# Altium schematic sheet Processor.SchDoc
size A; SheetNumber: 1; SheetTotal: 1
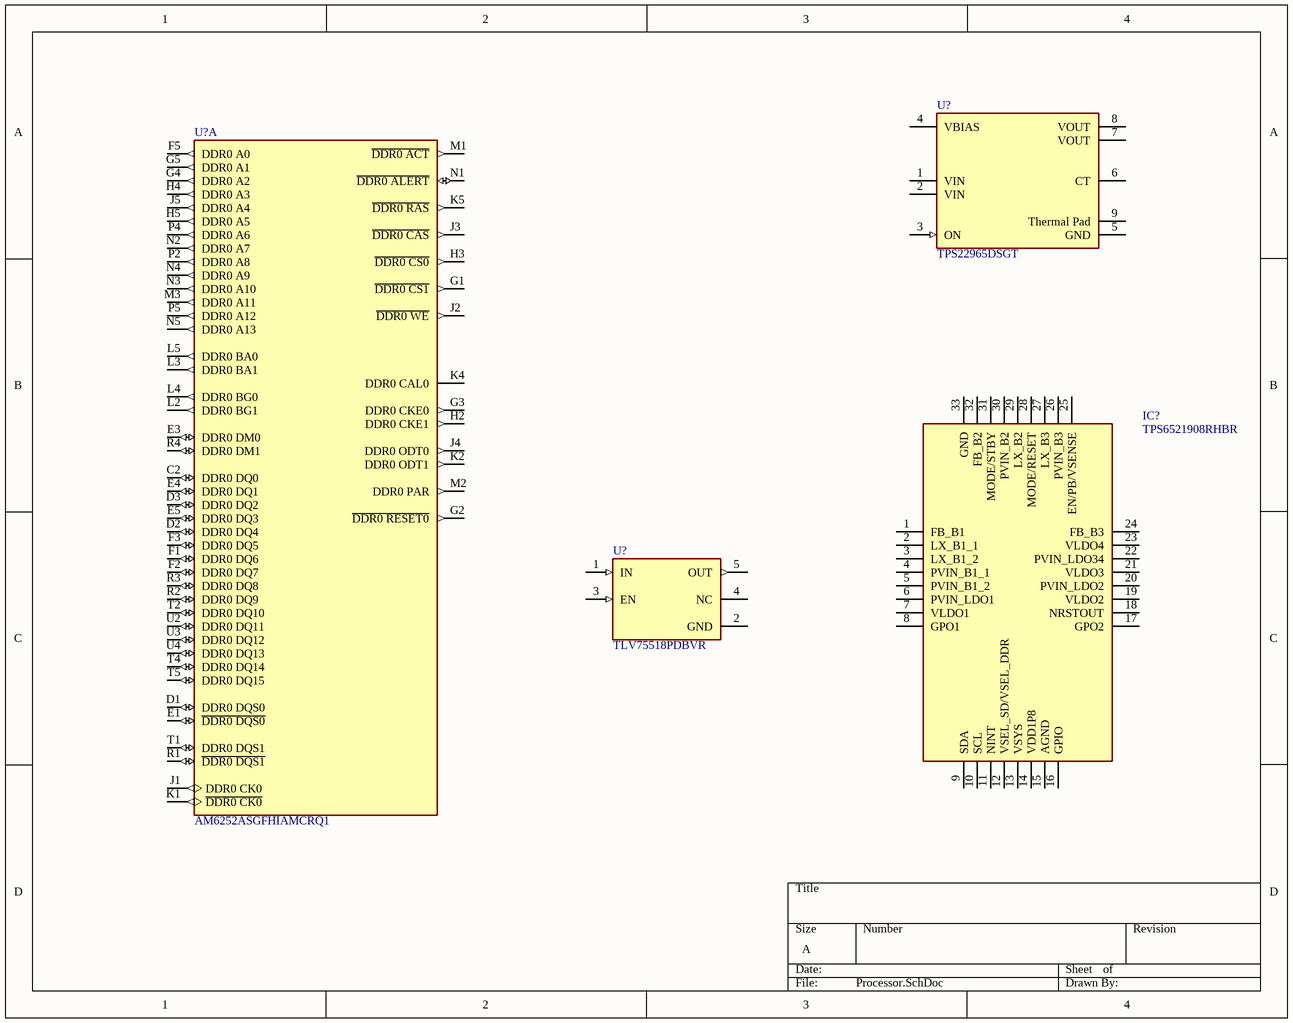
[diagram p0: Processor.SchDoc]

## Parts
(Parts that share a designator on the sheet are numbered #1, #2 ... from top to bottom, then left to right.)
IC?  TPS6521908RHBR  [QFN50P500X500X100-33N-D]
U?#1  TPS22965DSGT  [FP-DSG0008A-MFG]
U?#2  AM6252ASGFHIAMCRQ1  [FP-AMC0441A-MFG]  (part A of 13)
U?#3  TLV75518PDBVR  [FP-DBV0005A-IPC_A]

## Nets

Not connected (* = marked no-connect by the designer): IC? 1(FB_B1) 2(LX_B1_1) 3(LX_B1_2) 4(PVIN_B1_1) 5(PVIN_B1_2) 6(PVIN_LDO1) 7(VLDO1) 8(GPO1) 9(SDA) 10(SCL) 11(NINT) 12(VSEL_SD/VSEL_DDR) 13(VSYS) 14(VDD1P8) 15(AGND) 16(GPIO) 17(GPO2) 18(NRSTOUT) 19(VLDO2) 20(PVIN_LDO2) 21(VLDO3) 22(PVIN_LDO34) 23(VLDO4) 24(FB_B3) 25(EN/PB/VSENSE) 26(PVIN_B3) 27(LX_B3) 28(MODE/RESET) 29(LX_B2) 30(PVIN_B2) 31(MODE/STBY) 32(FB_B2) 33(GND); U?#1 1(VIN) 2(VIN) 3(ON) 4(VBIAS) 5(GND) 6(CT) 7(VOUT) 8(VOUT) 9(Thermal_Pad); U?#2 C2(DDR0_DQ0) D1(DDR0_DQS0) D2(DDR0_DQ4) D3(DDR0_DQ2) E1(~{DDR0_DQS0}) E3(DDR0_DM0) E4(DDR0_DQ1) E5(DDR0_DQ3) F1(DDR0_DQ6) F2(DDR0_DQ7) F3(DDR0_DQ5) F5(DDR0_A0) G1(~{DDR0_CS1}) G2(~{DDR0_RESET0}) G3(DDR0_CKE0) G4(DDR0_A2) G5(DDR0_A1) H2(DDR0_CKE1) H3(~{DDR0_CS0}) H4(DDR0_A3) H5(DDR0_A5) J1(DDR0_CK0) J2(~{DDR0_WE}) J3(~{DDR0_CAS}) J4(DDR0_ODT0) J5(DDR0_A4) K1(~{DDR0_CK0}) K2(DDR0_ODT1) K4(DDR0_CAL0) K5(~{DDR0_RAS}) L2(DDR0_BG1) L3(DDR0_BA1) L4(DDR0_BG0) L5(DDR0_BA0) M1(~{DDR0_ACT}) M2(DDR0_PAR) M3(DDR0_A11) N1(~{DDR0_ALERT}) N2(DDR0_A7) N3(DDR0_A10) N4(DDR0_A9) N5(DDR0_A13) P2(DDR0_A8) P4(DDR0_A6) P5(DDR0_A12) R1(~{DDR0_DQS1}) R2(DDR0_DQ9) R3(DDR0_DQ8) R4(DDR0_DM1) T1(DDR0_DQS1) T2(DDR0_DQ10) T4(DDR0_DQ14) T5(DDR0_DQ15) U2(DDR0_DQ11) U3(DDR0_DQ12) U4(DDR0_DQ13); U?#3 1(IN) 2(GND) 3(EN) 4(NC) 5(OUT)

## Library data of the parts
IC? = TPS6521908RHBR: Integrated Circuit; Manufacturer_Name: Texas Instruments; Datasheet Link: https://www.ti.com/product/TPS65219/part-details/TPS6521908RHBR?keyMatch=TPS6521908RHBR&tisearch=universal_search&usecase=OPN; Height: 1mm; Manufacturer_Part_Number: TPS6521908RHBR; Mouser Part Number: 595-TPS6521908RHBR; Mouser Price/Stock: https://www.mouser.co.uk/ProductDetail/Texas-Instruments/TPS6521908RHBR?qs=ST9lo4GX8V3r8g6AWJ0C8A%3D%3D; Supplier 1: DigiKey; Supplier Part Number 1: 296-TPS6521908RHBRCT-ND
U?#1 = CMP-04913-000004-1: IC PWR SWITCH N-CHAN 1:1 8WSON; Manufacturer: Texas Instruments; Nominal Supply Current: 20-50uA; Number Of Outputs: 1; Turn Off Delay Time: 9us; Turn On Delay Time: 730us; On State Resistance: 16mΩ; Min Supply Voltage: 2.5V; Max Junction Temp: +125°C; Output Current: 6A; Max Supply Voltage: 5.7V; Standoff Height: 0mm; Output Voltage: 0.8-5.7V; Digikey Description: IC PWR SWITCH N-CHAN 1:1 8WSON; ComponentLink2URL: http://www.ti.com/lit/ds/symlink/tps22965.pdf; Device Class L1: Integrated Circuits (ICs); Lead Free: Yes; RoHS: TRUE; Temperature Range Low: -40°C; Ambient Temperature Range Low: -40°C; Package: DSG0008A; Category: IC; Automotive: No; Height: 0.8mm; Ambient Temperature Range High: +105°C; ComponentLink2Description: Datasheet; Temperature Range High: +105°C; Device Class L3: Hot Swap Controllers; Temperature: -40°C to +105°C; Mouser Description: Power Switch ICs - Power Distribution Ultra-Lo rON,6A Load Switch; Manufacturer Part Number: TPS22965DSGT; Octopart: https://octopart.com/tps22965dsgt-texas+instruments-24334123; Number Of Channels: 1; Device Class L2: Power Management ICs
U?#2 = CMP-00370-141208177-1: AM6252ASGFHIAMCRQ1 Automotive display SoC with embedded safety for digital clusters 441-FCBGA -40 to 125; Manufacturer Lifecycle Status: ACTIVE; Thickness: 2.03mm; Width: 17.2mm; Number of Pins: 441; Lifecycle Status: Production; Height: 0m; Case/Package: FCBGA; Length: 17.2mm; NexarPartId: 141208177
U?#3 = CMP-04917-000157-1: IC REG LINEAR 1.8V 500MA SOT23-5; Output Configuration: Positive; Dropout Voltage: 400mV; Output Type: Fixed; Power Supply Rejection Ratio (PSRR): 52dB; Number of Regulators: 1; Quiescent Current: 31uA; Max Input Voltage: 5.5V; Max Output Voltage: 3.3V; Mount: Surface Mount; Min Operating Temperature: -40°C; Output Current: 500mA; Min Output Voltage: 1.8V; Packaging: Cut Tape; Max Operating Temperature: 125°C; Case/Package: SOT-23-5